# EAGLE design OLED-Pi H (EAGLE 9.6.2)
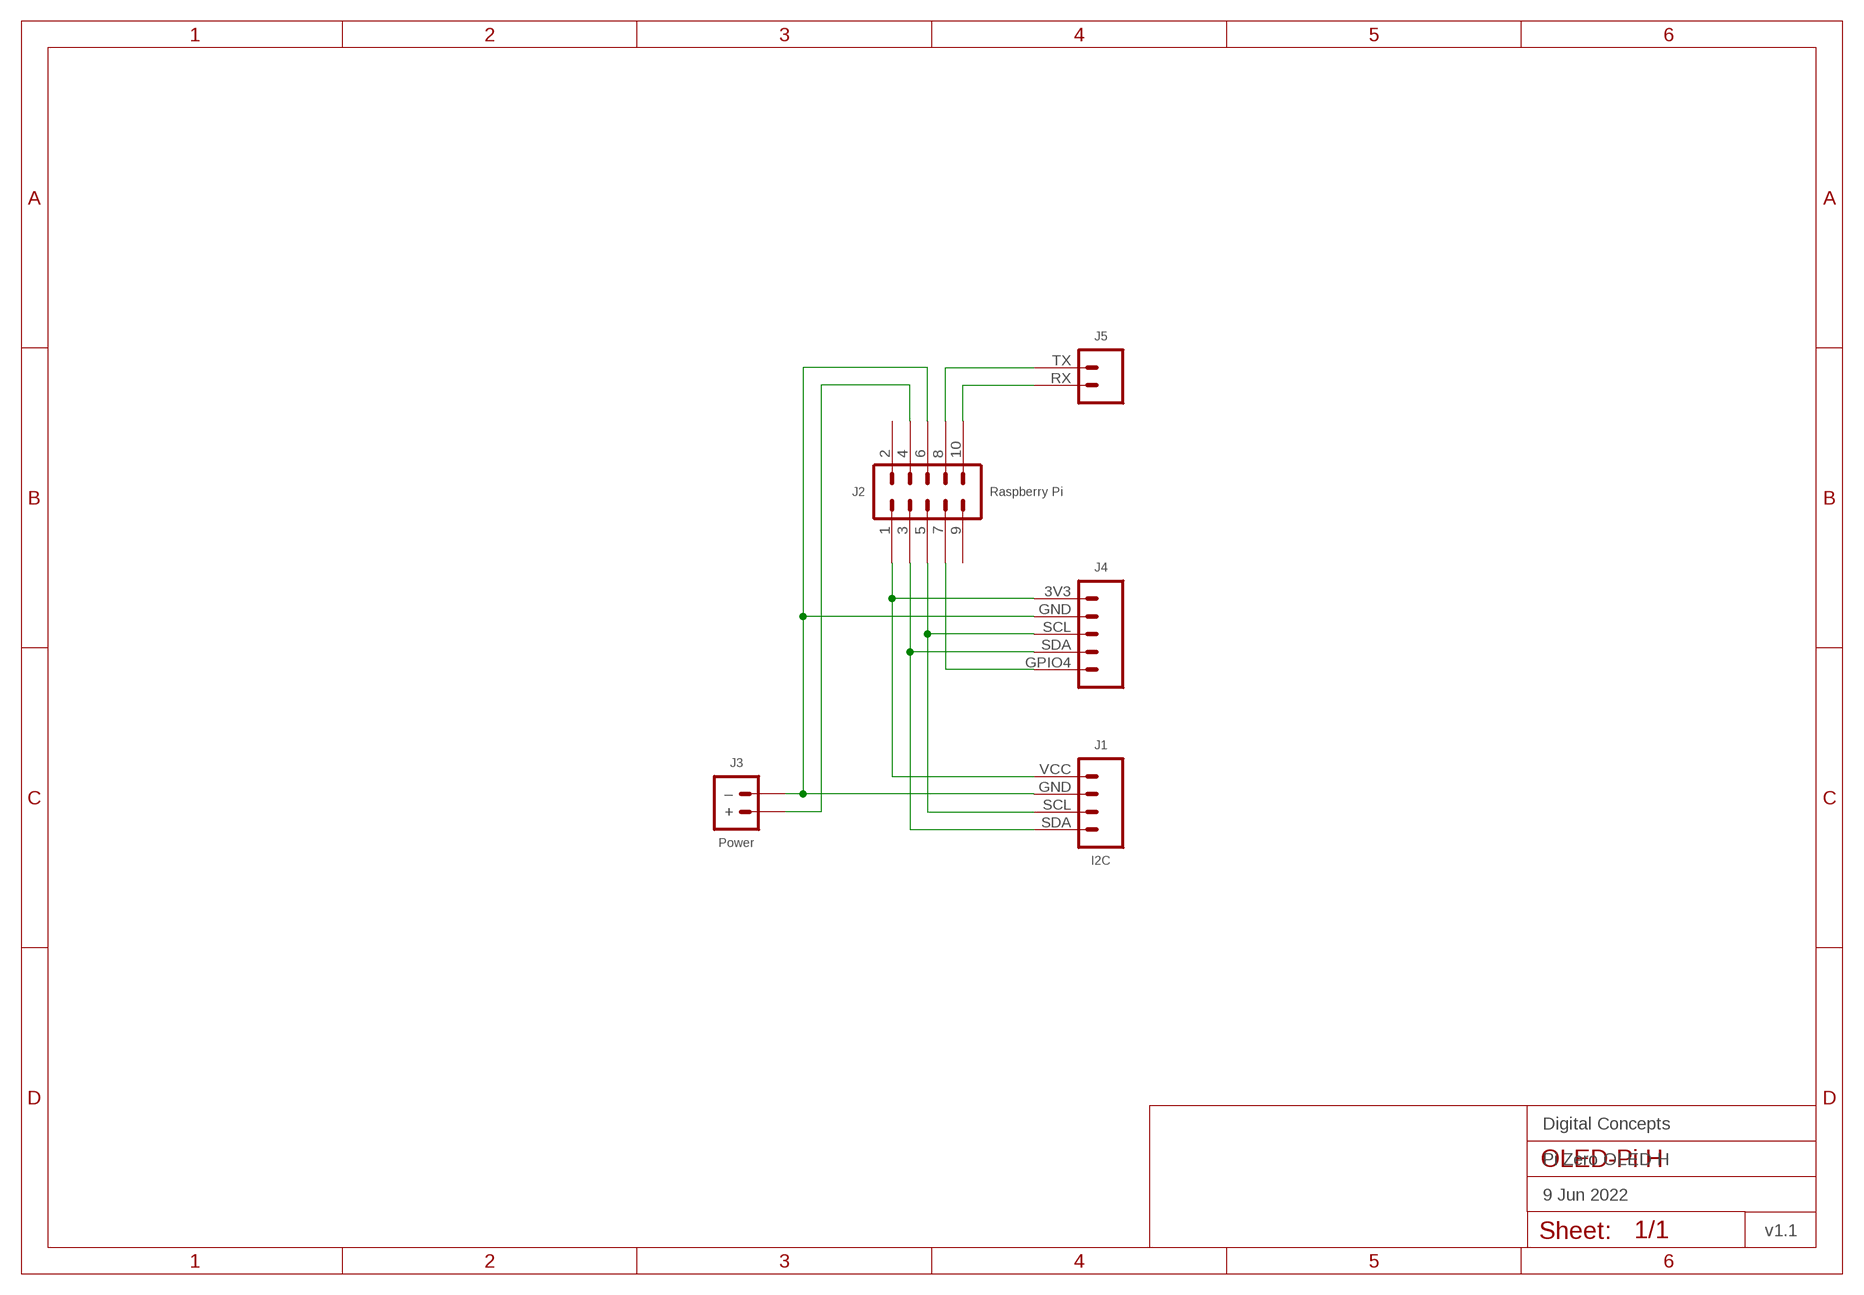
[diagram p0: schematic, sheet 1]
FRAME1 (FRAME-A4L-LOC): DATE: 9 Jun 2022; OWNER: Digital Concepts; TITLE: Pi Zero OLED H; VERSION: v1.1

## Parts
J1  I2C  HEADER-1X4-I2C  [CONN_04-I2C]
J2  Raspberry Pi  HEADER-2X5-PI-1  [CONN_2X5-PI-1]
J3  Power  JST-PH2.0-2-HORIZONTAL-POWERJST-PTH-2  [JST-PH2.0-2-HORIZONTAL-POWER]
J4  JST-PH2.0-5-HORIZONTAL-OLED-PI  [JST-PH2.0-5-HORIZONTAL-OLED-PI]
J5  JST-PH2.0-2-HORIZONTAL-TX-RXJST-PTH-2  [JST-PH2.0-2-HORIZONTAL=TX-RX]

## Nets
N$1: J1.GND J2.6 J3.-(–) J4.GND
N$2: J2.4 J3.+
N$3: J1.VCC J2.1 J4.3V3
N$4: J1.SDA J2.3 J4.SDA
N$5: J1.SCL J2.5 J4.SCL
N$6: J2.7 J4.GPIO4
N$7: J2.10 J5.RX
N$8: J2.8 J5.TX
Unconnected: J2.2 J2.9

## Library data of the parts
J1 = digitalconcepts:HEADER-1X4-I2C: I2C Interface [Pin 1 Vcc] 4-Pin Header
J2 = digitalconcepts:HEADER-2X5-PI-1: Ras-Pi 2x5 PTH Header Rapsberry Pi, starting at Pin 1
J3 = digitalconcepts:JST-PH2.0-2-HORIZONTAL-POWER: PH2.0 2P Right Angle PCB Connector; PROD_ID: CONN-09863; SKU: PRT-09914
J4 = digitalconcepts:JST-PH2.0-5-HORIZONTAL-OLED-PI: PH2.0 5P OLED-Pi Horizontal Connector
J5 = digitalconcepts:JST-PH2.0-2-HORIZONTAL-TX-RX: PH2.0 2P Right Angle PCB Connector with Tx/Rx Pin Labels; PROD_ID: CONN-09863; SKU: PRT-09914

## Board
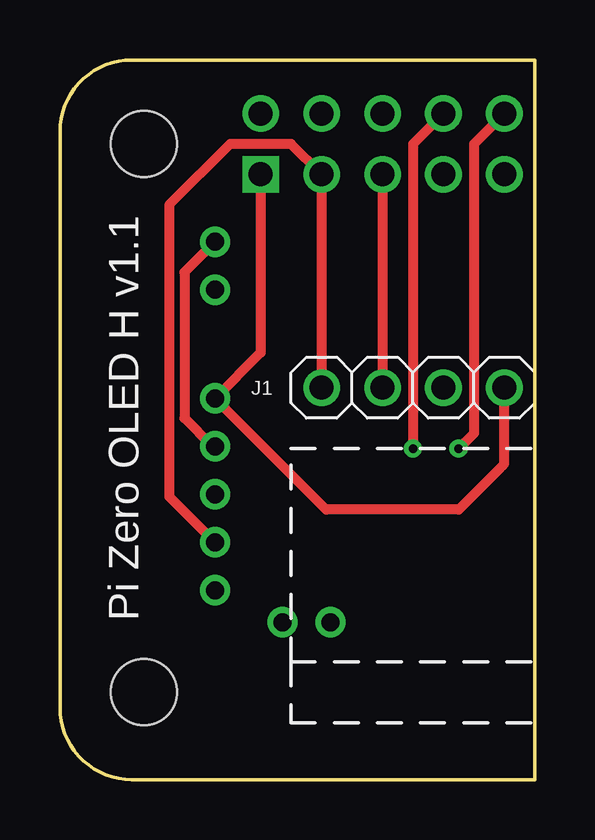
[diagram p1: board, top side]
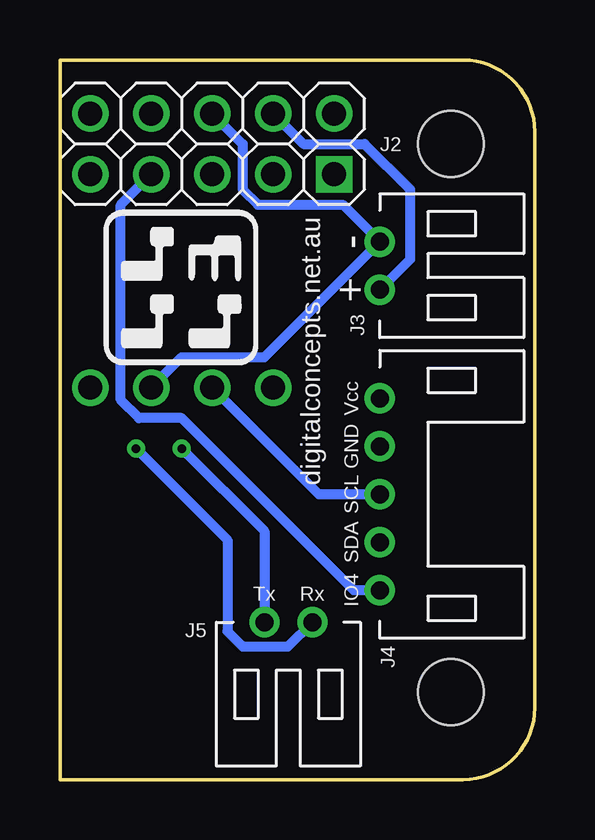
[diagram p2: board, bottom side, seen from below]

Size 19.8 x 30 mm. Coordinates in mm from the lower left corner, seen from the top.
Outline: 19.8,30 19.8,0 2.99,0 arc-90 0,2.99 0,27.01 arc-90 2.99,30 19.8,30
Copper layers (1*16): Top 0.035mm / dielectric 1.5mm / Bottom 0.035mm
Design rules "default *": minimum track width 6mil, minimum drill 0.35mm, track to track 6mil, track to pad 6mil, pad to pad 6mil, via to via 6mil, smd to smd 6mil, copper to edge 6mil, drill to drill 6mil, minimum pad ring 10mil, minimum via ring 8mil, stop-mask expansion 4mil, vias tented up to drill 0mil, thermal gap 10mil
Holes 2.75 mm at 3.5,26.5 3.5,3.64

### Footprints (pad centres in the part's own frame; a part is rotated, then mirrored left to right if it is on the bottom)
CONN_04-I2C = drill 1 pad 1.524: GND 2.54,0; SCL 5.08,0; SDA 7.62,0; VCC 0,0
CONN_2X5-PI-1 = drill 1 pad 1.524 square: 1 0,0 | drill 1 pad 1.524: 2 0,2.54; 3 2.54,0; 4 2.54,2.54; 5 5.08,0; 6 5.08,2.54; 7 7.62,0; 8 7.62,2.54; 9 10.16,0; 10 10.16,2.54
JST-PH2.0-2-HORIZONTAL-POWER = drill 0.75: + 1,0; - -1,0
JST-PH2.0-5-HORIZONTAL-OLED-PI = drill 0.75: 3V3 4,0; GND 2,0; GPIO4 -4,0; SCL 0,0; SDA -2,0
JST-PH2.0-2-HORIZONTAL=TX-RX = drill 0.75: RX -1,0; TX 1,0

### Placement (x,y rotation side)
J1  18.53,16.34 180 top
J2  8.37,25.23 0 top
J3  6.47,21.42 270 bottom
J4  6.47,11.89 90 bottom
J5  10.28,6.56 180 bottom

### Tracks (layer width: path | path; a pad name or v marks a point on that pad's centre or on a via)
N$1
  Top 0.406: J3.- 5.2,21.15 5.2,15.07 6.37,13.89 J4.GND
  Bottom 0.406: J2.6 12.18,26.5 12.18,24.59 11.55,23.96 8.01,23.96 J3.- 11.28,17.61 14.72,17.61 J1.GND
N$2
  Bottom 0.406: J3.+ 5.2,21.69 5.2,24.59 7.1,26.5 9.64,26.5 J2.4
N$3
  Top 0.406: J1.VCC 18.53,13.16 16.63,11.26 11.1,11.26 J4.3V3 8.37,17.8 J2.1
N$4
  Top 0.406: J1.SDA J2.3 9.64,26.5 7.1,26.5 4.56,23.96 4.56,11.8 J4.SDA
N$5
  Top 0.406: J2.5 J1.SCL
  Bottom 0.406: J1.SCL 9.01,11.89 J4.SCL
N$6
  Bottom 0.406: J4.GPIO4 7.55,7.89 14.72,15.07 16.5,15.07 17.26,15.83 17.26,23.96 J2.7
N$7  (via drill 0.35)
  Top 0.406: J2.10 17.26,26.5 17.26,14.43 v16.63,13.8
  Bottom 0.406: v16.63,13.8 12.82,9.99 12.82,6.18 12.18,5.54 10.29,5.54 J5.RX
N$8  (via drill 0.35)
  Top 0.406: J2.8 14.72,26.5 v14.72,13.8
  Bottom 0.406: v14.72,13.8 11.28,10.35 J5.TX

### Text on the board
tPlace: Pi Zero OLED H v1.1
bPlace: digitalconcepts.net.au
bNames: Vcc | GND | SCL | SDA | IO4 | Rx | Tx
tValues: SDA | SCL | GND | VCC
bValues: 5V